# EAGLE design motherboard (EAGLE 5.04)
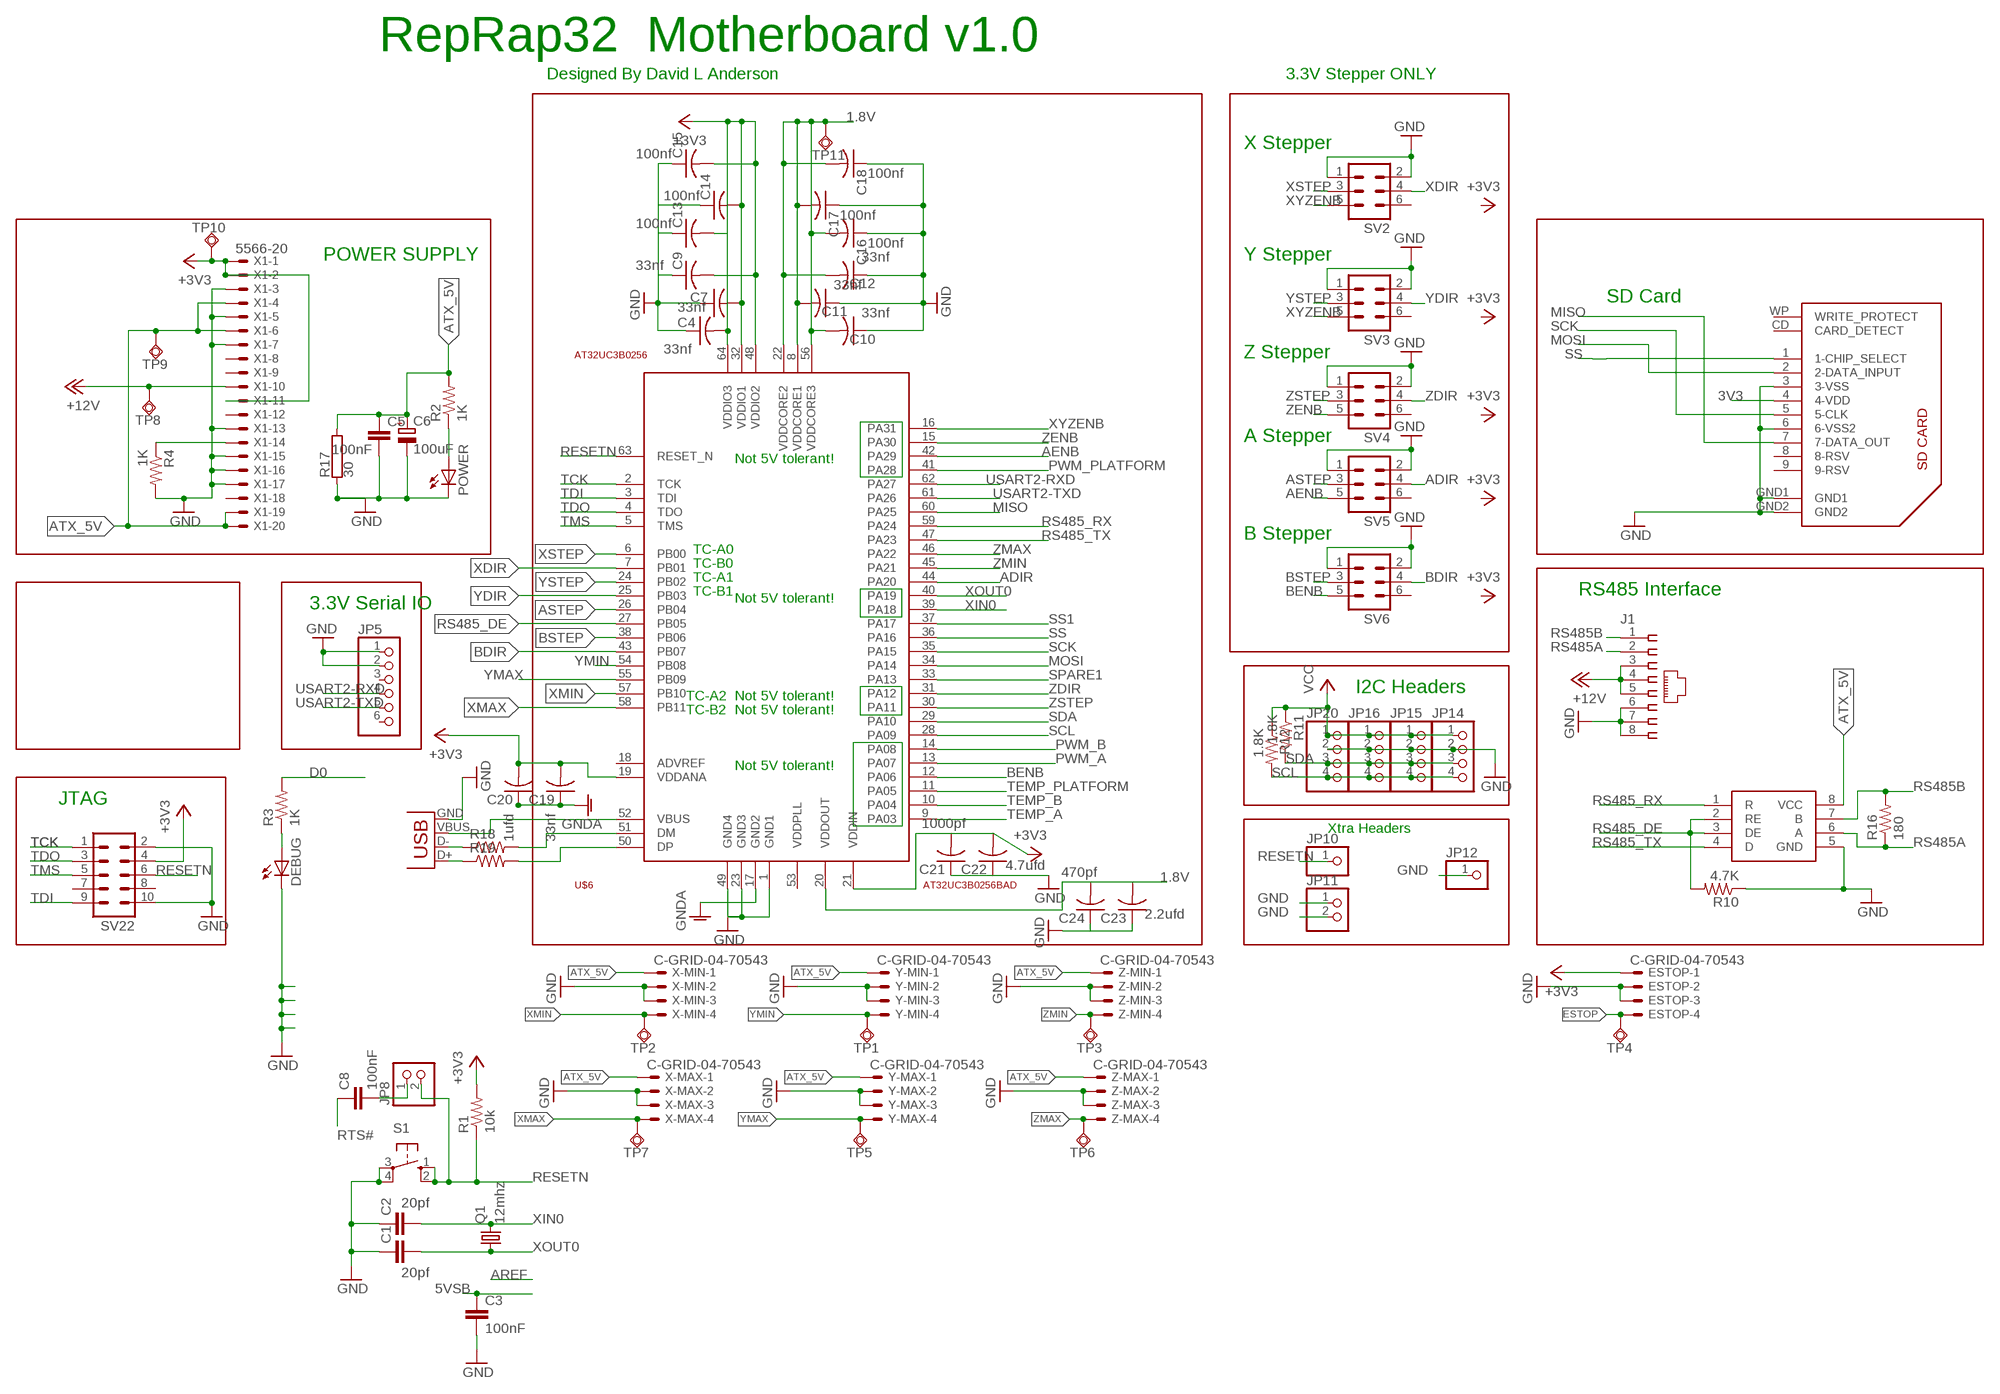
[diagram p0: schematic, sheet 1]

## Parts
C1  20pf  C-EUC1206  [C1206]
C2  20pf  C-EUC1206  [C1206]
C3  100nF  C-EUC1206  [C1206]
C4  33nf  C-USC0603K  [C0603K]
C5  100nF  C-EUC1206  [C1206]
C6  100uF  CPOL-EUSANYO_SMD_B6  [SANYO-OSCON_SMD_B6]
C7  33nf  C-USC0603K  [C0603K]
C8  100nF  C-EUC1206  [C1206]
C9  33nf  C-USC0603K  [C0603K]
C10  33nf  C-USC0603K  [C0603K]
C11  33nf  C-USC0603K  [C0603K]
C12  33nf  C-USC0603K  [C0603K]
C13  100nf  C-USC0603K  [C0603K]
C14  100nf  C-USC0603K  [C0603K]
C15  100nf  C-USC0603K  [C0603K]
C16  100nf  C-USC0603K  [C0603K]
C17  100nf  C-USC0603K  [C0603K]
C18  100nf  C-USC0603K  [C0603K]
C19  33nf  C-USC0603K  [C0603K]
C20  1ufd  C-USC0603K  [C0603K]
C21  1000pf  C-USC0603K  [C0603K]
C22  4.7ufd  C-USC0603K  [C0603K]
C23  2.2ufd  C-USC0603K  [C0603K]
C24  470pf  C-USC0603K  [C0603K]
DEBUG  LEDCHIPLED_1206  [CHIPLED_1206]
ESTOP  C-GRID-04-70543  [70543-04]
IC1  SN75176ASOIC  [SO08]
J1  555164-1  [555164-1]
JP5  PINHD-1X6  [1X06]
JP8  PINHD-1X2  [1X02]
JP10  PINHD-1X1  [1X01]
JP11  PINHD-1X2  [1X02]
JP12  PINHD-1X1  [1X01]
JP14  PINHD-1X4  [1X04]
JP15  PINHD-1X4  [1X04]
JP16  PINHD-1X4  [1X04]
JP20  PINHD-1X4  [1X04]
POWER  LEDCHIPLED_1206  [CHIPLED_1206]
Q1  12mhz  CRYSTAL5X3  [CRYSTAL-SMD-5X3]
R1  10k  R-US_R0603  [R0603]
R2  1K  R-US_R1206  [R1206]
R3  1K  R-US_R1206  [R1206]
R4  1K  R-US_R1206  [R1206]
R10  4.7K  R-US_R1206  [R1206]
R11  1.8K  R-US_R1206  [R1206]
R12  1.8K  R-US_R1206  [R1206]
R16  180  R-US_R1206  [R1206]
R17  30  RKH206-8  [KH206-8]
R18  R-US_R0603  [R0603]
R19  R-US_R0603  [R0603]
S1  10-XX  [B3F-10XX]
SV2  ML6  [ML6]
SV3  ML6  [ML6]
SV4  ML6  [ML6]
SV5  ML6  [ML6]
SV6  ML6  [ML6]
SV22  ML10  [ML10]
TP1  TPSQTP09R  [TP09R]
TP2  TPSQTP09R  [TP09R]
TP3  TPSQTP09R  [TP09R]
TP4  TPSQTP09R  [TP09R]
TP5  TPSQTP09R  [TP09R]
TP6  TPSQTP09R  [TP09R]
TP7  TPSQTP09R  [TP09R]
TP8  TPSQTP09R  [TP09R]
TP9  TPSQTP09R  [TP09R]
TP10  TPSQTP09R  [TP09R]
TP11  TPSQTP09R  [TP09R]
U$6  AT32UC3B0256BAD  [TQFP64]
U$8  SDCARD  [3M-SDCARD]
X1  5566-20  [5566-20]
X2  USBSMD  [USB-MINIB]
X-MAX  C-GRID-04-70543  [70543-04]
X-MIN  C-GRID-04-70543  [70543-04]
Y-MAX  C-GRID-04-70543  [70543-04]
Y-MIN  C-GRID-04-70543  [70543-04]
Z-MAX  C-GRID-04-70543  [70543-04]
Z-MIN  C-GRID-04-70543  [70543-04]

## Nets
1.8V: C10.2 C11.2 C12.2 C16.2 C17.2 C18.2 C23.2 C24.2 TP11.TP U$6.8(VDDCORE1) U$6.20(VDDOUT) U$6.22(VDDCORE2) U$6.56(VDDCORE3)
3V3: U$8.4(4-VDD)
5VSB: C3.1
+3V3: C4.2 C7.2 C9.2 C13.2 C14.2 C15.2 C19.2 C20.2 C21.2 C22.2 ESTOP.1 R1.2 SV22.4 TP10.TP U$6.19(VDDANA) U$6.21(VDDIN) U$6.32(VDDIO1) U$6.48(VDDIO2) U$6.64(VDDIO3) X1.1 X1.2 X1.11
+12V: J1.3 J1.4 J1.5 TP8.TP X1.10
ADIR: SV5.4 U$6.44(PA20)
AENB: SV5.5 U$6.42(PA29)
ASTEP: SV5.3 U$6.26(PB04)
ATX_5V [usbvcc]: C5.1 C6.+ IC1.8(VCC) R2.2 R17.2 TP9.TP X1.4 X1.6 X1.19 X1.20 X-MAX.1 X-MIN.1 Y-MAX.1 Y-MIN.1 Z-MAX.1 Z-MIN.1
BDIR: SV6.4 U$6.43(PB07)
BENB: SV6.5 U$6.12(PA06)
BSTEP: SV6.3 U$6.38(PB06)
D0: R3.2
ESTOP: ESTOP.4 TP4.TP
GND [power]: C1.1 C2.1 C3.2 C4.1 C5.2 C6.- C7.1 C9.1 C10.1 C11.1 C12.1 C13.1 C14.1 C15.1 C16.1 C17.1 C18.1 C21.1 C22.1 C23.1 C24.1 DEBUG.C ESTOP.2 ESTOP.3 IC1.5(GND) J1.6 J1.7 J1.8 JP5.1 JP5.2 JP11.1 JP11.2 JP12.1 JP14.2 JP15.2 JP16.2 JP20.2 POWER.C R4.2 R10.1 R17.1 S1.3(P) S1.4(P1) SV2.1 SV2.2 SV3.1 SV3.2 SV4.1 SV4.2 SV5.1 SV5.2 SV6.1 SV6.2 SV22.2 SV22.10 U$6.1(GND1) U$6.23(GND3) U$6.49(GND4) U$8.3(3-VSS) U$8.6(6-VSS2) U$8.GND1 U$8.GND2 X1.3 X1.5 X1.7 X1.13 X1.15 X1.16 X1.17 X2.GND X-MAX.2 X-MAX.3 X-MIN.2 X-MIN.3 Y-MAX.2 Y-MAX.3 Y-MIN.2 Y-MIN.3 Z-MAX.2 Z-MAX.3 Z-MIN.2 Z-MIN.3
GNDA: C19.1 C20.1 U$6.17(GND2)
MISO: U$6.60(PA25) U$8.7(7-DATA_OUT)
MOSI: U$6.34(PA14) U$8.2(2-DATA_INPUT)
N$3: R18.2 U$6.51(DM)
N$4: POWER.A R2.1
N$5: R4.1 X1.14
N$6: R19.2 U$6.50(DP)
N$7: DEBUG.A R3.1
N$9: R18.1 X2.D-
N$10: R19.1 X2.D+
N$11: U$6.52(VBUS) X2.VBUS
N$21: C8.2 JP8.1
PWM_A: U$6.13(PA07)
PWM_B: U$6.14(PA08)
PWM_PLATFORM: U$6.41(PA28)
RESETN: JP8.2 JP10.1 R1.1 S1.1(S) S1.2(S1) SV22.6 U$6.63(RESET_N)
RS485_DE: IC1.2(RE) IC1.3(DE) R10.2 U$6.27(PB05)
RS485_RX: IC1.1(R) U$6.59(PA24)
RS485_TX: IC1.4(D) U$6.47(PA23)
RS485A: IC1.6(A) J1.2 R16.1
RS485B: IC1.7(B) J1.1 R16.2
RTS#: C8.1
SCK: U$6.35(PA15) U$8.5(5-CLK)
SCL: JP14.4 JP15.4 JP16.4 JP20.4 R12.2 U$6.28(PA09)
SDA: JP14.3 JP15.3 JP16.3 JP20.3 R11.2 U$6.29(PA10)
SPARE1: U$6.33(PA13)
SS: U$6.36(PA16) U$8.1(1-CHIP_SELECT)
SS1: U$6.37(PA17)
TCK: SV22.1 U$6.2(TCK)
TDI: SV22.9 U$6.3(TDI)
TDO: SV22.3 U$6.4(TDO)
TEMP_A: U$6.9(PA03)
TEMP_B: U$6.10(PA04)
TEMP_PLATFORM: U$6.11(PA05)
TMS: SV22.5 U$6.5(TMS)
USART2-RXD: JP5.4 U$6.62(PA27)
USART2-TXD: JP5.5 U$6.61(PA26)
VCC [power]: JP14.1 JP15.1 JP16.1 JP20.1 R11.1 R12.1
XDIR: SV2.4 U$6.7(PB01)
XIN0: C2.2 Q1.3 U$6.39(PA18)
XMAX: TP7.TP U$6.58(PB11) X-MAX.4
XMIN: TP2.TP U$6.57(PB10) X-MIN.4
XOUT0: C1.2 Q1.1 U$6.40(PA19)
XSTEP: SV2.3 U$6.6(PB00)
XYZENB: SV2.5 SV3.5 U$6.16(PA31)
YDIR: SV3.4 U$6.25(PB03)
YMAX: TP5.TP U$6.55(PB09) Y-MAX.4
YMIN: TP1.TP U$6.54(PB08) Y-MIN.4
YSTEP: SV3.3 U$6.24(PB02)
ZDIR: SV4.4 U$6.31(PA12)
ZENB: SV4.5 U$6.15(PA30)
ZMAX: TP6.TP U$6.46(PA22) Z-MAX.4
ZMIN: TP3.TP U$6.45(PA21) Z-MIN.4
ZSTEP: SV4.3 U$6.30(PA11)
Unconnected: JP5.3 JP5.6 SV2.6 SV3.6 SV4.6 SV5.6 SV6.6 SV22.7 SV22.8 U$6.18(ADVREF) U$6.53(VDDPLL) U$8.8(8-RSV) U$8.9(9-RSV) U$8.CD(CARD_DETECT) U$8.WP(WRITE_PROTECT) X1.8 X1.9 X1.12 X1.18

## Notes on the sheet
- RepRap32  Motherboard v1.0
- Designed By David L Anderson | 3.3V Stepper ONLY
- X Stepper
- POWER SUPPLY | Y Stepper
- SD Card
- Z Stepper
- A Stepper
- Not 5V tolerant!
- B Stepper
- TC-A0
- TC-B0
- TC-A1
- TC-B1 | RS485 Interface
- Not 5V tolerant!
- 3.3V Serial IO
- I2C Headers
- TC-A2 | Not 5V tolerant!
- TC-B2 | Not 5V tolerant!
- Not 5V tolerant!
- JTAG
- Xtra Headers

## Library data of the parts
C1-C3 C5 C8 = rcl:C-EU: CAPACITOR, European symbol
C4 C7 C9-C24 = rcl:C-US: CAPACITOR, American symbol
C6 = rcl:CPOL-EU: POLARIZED CAPACITOR, European symbol
DEBUG POWER = led:LED: LED OSRAM: - CHIPLED LG R971, LG N971, LY N971, LG Q971, LY Q971, LO R971, LY R971 LH N974, LH R974 LS Q976, LO Q976, LY Q976 LO Q996 - Hyper CHIPLED LW Q18S LB Q993, LB Q99A, LB R99A - SideLED LS A670, LO A670, LY A670, LG A670, LP A670 LB A673, LV A673, LT A673, LW A673 LH A674 LY A675 LS A676, LA A676, LO A676, LY A676, LW A676 LS A679, LY A679, LG A679 - Hyper Micro SIDELED® LS Y876, LA Y876, LO Y876, LY Y876 LT Y87S - SmartLED LW L88C, LW L88S LB L89C, LB L89S, LG L890 LS L89K, LO L89K, LY L89K LS L896, LA L896, LO L896, LY L896 - TOPLED LS T670, LO T670, LY T670, LG T670, LP T670 LSG T670, LSP T670, LSY T670, LOP T670, LYG T670 LG T671, LOG T671, LSG T671 LB T673, LV T673, LT T673, LW T673 LH T674 LS T676, LA T676, LO T676, LY T676, LB T676, LH T676, LSB T676, LW T676 LB T67C, LV T67C, LT T67C, LS T67K, LO T67K, LY T67K, LW E67C LS E67B, LA E67B, LO E67B, LY E67B, LB E67C, LV E67C, LT E67C LW T67C LS T679, LY T679, LG T679 LS T770, LO T770, LY T770, LG T770, LP T770 LB T773, LV T773, LT T773, LW T773 LH T774 LS E675, LA E675, LY E675, LS T675 LS T776, LA T776, LO T776, LY T776, LB T776 LHGB T686 LT T68C, LB T68C - Hyper Mini TOPLED® LB M676 - Mini TOPLED Santana® LG M470 LS M47K, LO M47K, LY M47K Source: http://www.osram.convergy.de - LUMILED® LXK2-PW12-R00, LXK2-PW12-S00, LXK2-PW14-U00, LXK2-PW14-V00 LXK2-PM12-R00, LXK2-PM12-S00, LXK2-PM14-U00 LXK2-PE12-Q00, LXK2-PE12-R00, LXK2-PE12-S00, LXK2-PE14-T00, LXK2-PE14-U00 LXK2-PB12-K00, LXK2-PB12-L00, LXK2-PB12-M00, LXK2-PB14-N00, LXK2-PB14-P00, LXK2-PB14-Q00 LXK2-PR12-L00, LXK2-PR12-M00, LXK2-PR14-Q00, LXK2-PR14-R00 LXK2-PD12-Q00, LXK2-PD12-R00, LXK2-PD12-S00 LXK2-PH12-R00, LXK2-PH12-S00 LXK2-PL12-P00, LXK2-PL12-Q00, LXK2-PL12-R00 Source: www.luxeon.com
ESTOP X-MAX X-MIN Y-MAX Y-MIN Z-MAX Z-MIN = con-molex:C-GRID-04: CONNECTOR wire to board 2.54 mm (0.100") pitch header
IC1 = reprap:SN75176A
J1 = con-amp:555164-1: AMP connector
JP5 = pinhead:PINHD-1X6: PIN HEADER
JP8 JP11 = pinhead:PINHD-1X2: PIN HEADER
JP10 JP12 = pinhead:PINHD-1X1: PIN HEADER
JP14-JP16 JP20 = pinhead:PINHD-1X4: PIN HEADER
Q1 = SparkFun_4_13_2010:CRYSTAL: Crystals Various standard crystals. Proven footprints. Spark Fun Electronics SKU : COM-00534
R1 R2 R4 R10-R12 R16 R18 R19 = rcl:R-US_: RESISTOR, American symbol
R3 = resistor:R-US_: RESISTOR, American symbol
R17 = resistor-power:R: Power Resitor
S1 = switch-omron:10-XX: OMRON SWITCH
SV2-SV6 = con-ml:ML6: HARTING
SV22 = con-harting-ml:ML10: HARTING
TP1-TP11 = testpad:TPSQ: Test pad
U$6 = dave2010:AT32UC3B0256
U$8 = reprap:SDCARD
X1 = con-molex:5566-20: Mini FIT connector 20 pol ATX PC-Motherboard Power connector Source: http://www.molex.com
X2 = SparkFun_4_13_2010:USB: USB Connectors USB-B-PTH is fully proven SKU : PRT-00139 USB-miniB is fully proven SKU : PRT-00587 USB-A-PCB is untested. USB-A-H is throughly reviewed, but untested. Spark Fun Electronics SKU : PRT-00437 USB-B-SMT is throughly reviewed, but untested. Needs silkscreen touching up. USB-A-S has not been used/tested USB-MB-H has not been used/tested

## Net classes
0 default: width 0.406 mm, clearance 0.305 mm
1 power: width 0.635 mm, clearance 0.406 mm
2 gnd: width 0.305 mm, drill 0.711 mm, clearance 0.203 mm
3 usbvcc: width 0.508 mm, drill 0.711 mm, clearance 0.203 mm

## Board
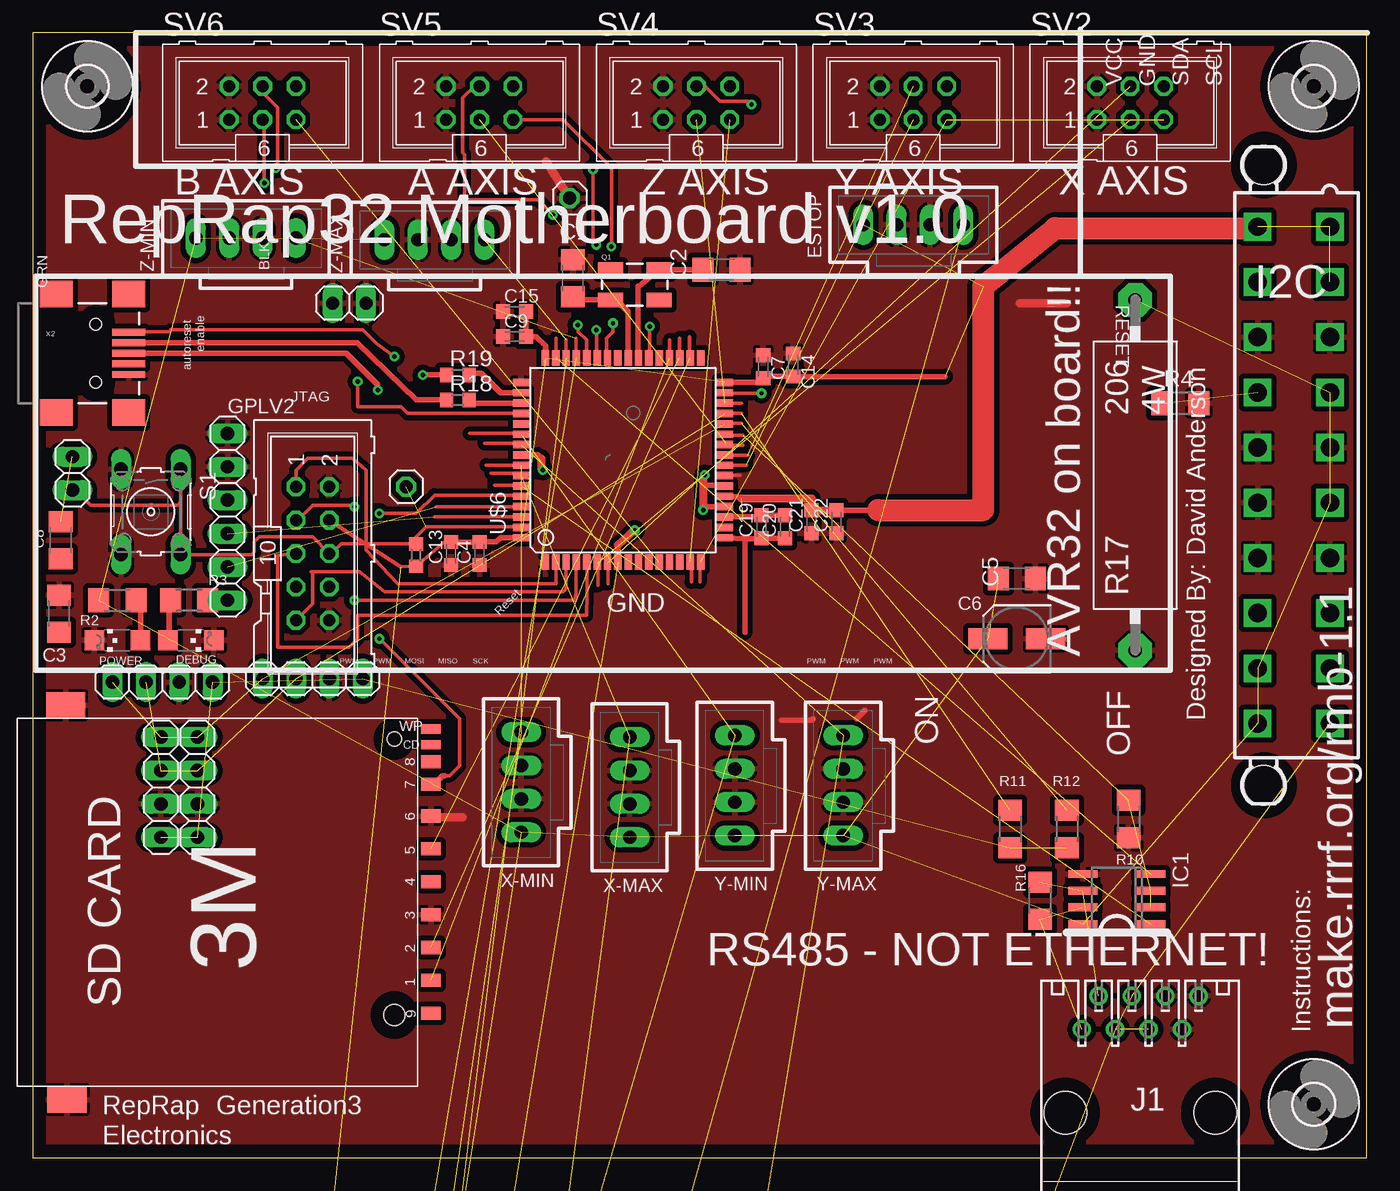
[diagram p1: board, top side]
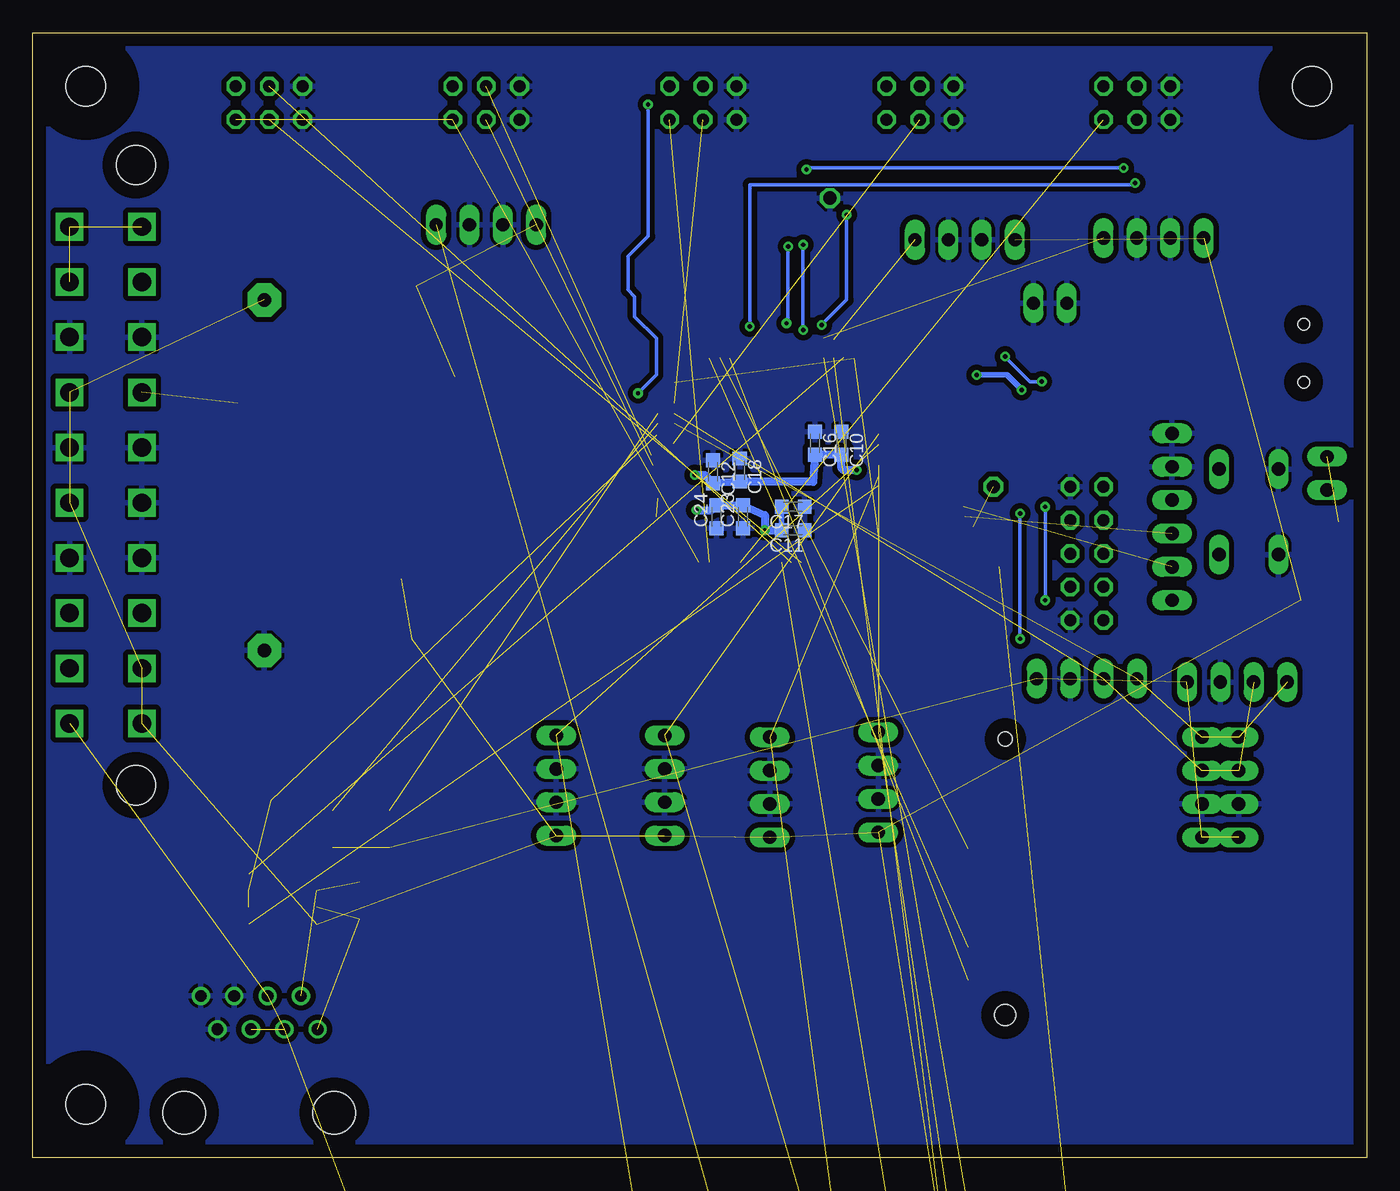
[diagram p2: board, bottom side, seen from below]

Size 101.52 x 85.59 mm. Coordinates in mm from the lower left corner, seen from the top.
Outline: 0,0 101.52,0 101.52,85.59 0,85.59 0,0
Copper layers (1*16): Top 0.035mm / dielectric 1.5mm / Bottom 0.035mm
Design rules "default *": minimum track width 10mil, minimum drill 24mil, track to track 8mil, track to pad 8mil, pad to pad 8mil, via to via 8mil, smd to smd 8mil, copper to edge 40mil, drill to drill 8mil, minimum pad ring 10mil, minimum via ring 8mil, stop-mask expansion 4mil, vias tented up to drill 0mil, thermal gap 10mil

### Footprints (pad centres in the part's own frame; a part is rotated, then mirrored left to right if it is on the bottom)
C1206 = smd 1.6 x 1.8: 1 -1.4,0; 2 1.4,0
C0603K = smd 1.05 x 1.08: 1 -0.875,0; 2 0.875,0
SANYO-OSCON_SMD_B6 = smd 3 x 1.6: + 2.2,0; - -2.2,0
CHIPLED_1206 = smd 1.5 x 1.5: A 0,-1.75; C 0,1.75
70543-04 = drill 1.016 long: 1 -3.81,0; 2 -1.27,0; 3 1.27,0; 4 3.81,0
SO08 = smd 0.6 x 2.2: 1 -1.905,-2.6; 2 -0.635,-2.6; 3 0.635,-2.6; 4 1.905,-2.6; 5 1.905,2.6; 6 0.635,2.6; 7 -0.635,2.6; 8 -1.905,2.6
555164-1 = drill 0.889 round: 1 -4.445,5.207; 2 -3.175,7.747; 3 -1.905,5.207; 4 -0.635,7.747; 5 0.635,5.207; 6 1.905,7.747; 7 3.175,5.207; 8 4.445,7.747 | hole 3.251: -5.715,-1.143; 5.715,-1.143
1X06 = drill 1.016 long: 1 -6.35,0; 2 -3.81,0; 3 -1.27,0; 4 1.27,0; 5 3.81,0; 6 6.35,0
1X02 = drill 1.016 long: 1 -1.27,0; 2 1.27,0
1X01 = drill 1.016 octagon: 1 0,0
1X04 = drill 1.016 long: 1 -3.81,0; 2 -1.27,0; 3 1.27,0; 4 3.81,0
CRYSTAL-SMD-5X3 = smd 1.9 x 1.1: 1 -1.85,-1.15; 2 1.85,-1.15; 3 1.85,1.15; 4 -1.85,1.15
R0603 = smd 1 x 1.1: 1 -0.85,0; 2 0.85,0
R1206 = smd 1.6 x 1.803: 1 -1.422,0; 2 1.422,0
KH206-8 = drill 1.016 pad 2.54 octagon: 1 -13.335,0; 2 13.335,0
B3F-10XX = drill 1.016 long: 1 -3.251,2.261; 2 3.251,2.261; 3 -3.251,-2.261; 4 3.251,-2.261
ML6 = drill 0.914 octagon: 1 -2.54,-1.27; 2 -2.54,1.27; 3 0,-1.27; 4 0,1.27; 5 2.54,-1.27; 6 2.54,1.27
ML10 = drill 0.914 octagon: 1 -5.08,-1.27; 2 -5.08,1.27; 3 -2.54,-1.27; 4 -2.54,1.27; 5 0,-1.27; 6 0,1.27; 7 2.54,-1.27; 8 2.54,1.27; 9 5.08,-1.27; 10 5.08,1.27
TP09R = smd 0.9 x 0.9: TP 0,0
3,0 = hole 3: 0,0
TQFP64 = smd 1.194 x 0.559: 1 -7.76,5.905; 2 -7.76,5.118; 3 -7.76,4.331; 4 -7.76,3.543; 5 -7.76,2.756; 6 -7.76,1.968; 7 -7.76,1.181; 8 -7.76,0.394; 9 -7.76,-0.394; 10 -7.76,-1.181; 11 -7.76,-1.968; 12 -7.76,-2.756; 13 -7.76,-3.543; 14 -7.76,-4.331; 15 -7.76,-5.118; 16 -7.76,-5.905; 33 7.76,-5.905; 34 7.76,-5.118; 35 7.76,-4.331; 36 7.76,-3.543; 37 7.76,-2.756; 38 7.76,-1.968; 39 7.76,-1.181; 40 7.76,-0.394; 41 7.76,0.394; 42 7.76,1.181; 43 7.76,1.968; 44 7.76,2.756; 45 7.76,3.543; 46 7.76,4.331; 47 7.76,5.118; 48 7.76,5.905 | smd 0.559 x 1.194: 17 -5.905,-7.76; 18 -5.118,-7.76; 19 -4.331,-7.76; 20 -3.543,-7.76; 21 -2.756,-7.76; 22 -1.968,-7.76; 23 -1.181,-7.76; 24 -0.394,-7.76; 25 0.394,-7.76; 26 1.181,-7.76; 27 1.968,-7.76; 28 2.756,-7.76; 29 3.543,-7.76; 30 4.331,-7.76; 31 5.118,-7.76; 32 5.905,-7.76; 49 5.905,7.76; 50 5.118,7.76; 51 4.331,7.76; 52 3.543,7.76; 53 2.756,7.76; 54 1.968,7.76; 55 1.181,7.76; 56 0.394,7.76; 57 -0.394,7.76; 58 -1.181,7.76; 59 -1.968,7.76; 60 -2.756,7.76; 61 -3.543,7.76; 62 -4.331,7.76; 63 -5.118,7.76; 64 -5.905,7.76
3M-SDCARD = smd 1 x 1.5: 1 5.93,16.5; 2 3.43,16.5; 3 0.93,16.5; 4 -1.57,16.5; 5 -4.07,16.5; 6 -6.57,16.5; 7 -9,16.5; 8 -10.7,16.5; 9 8.43,16.5 | smd 0.7 x 1.5: CD -12,16.5; WP -13.2,16.5 | smd 2 x 3: GND1 -15,-11.3; GND2 15,-11.2 | hole 1.1: -12.427,13.705 | hole 1.6: 8.567,13.708
5566-20 = drill 1.4 square: 1 18.9,-2.75; 2 14.7,-2.75; 3 10.5,-2.75; 4 6.3,-2.75; 5 2.1,-2.75; 6 -2.1,-2.75; 7 -6.3,-2.75; 8 -10.5,-2.75; 9 -14.7,-2.75; 10 -18.9,-2.75; 11 18.9,2.75; 12 14.7,2.75; 13 10.5,2.75; 14 6.3,2.75; 15 2.1,2.75; 16 -2.1,2.75; 17 -6.3,2.75; 18 -10.5,2.75; 19 -14.7,2.75; 20 -18.9,2.75 | hole 3: 23.6,2.29; -23.6,2.29
USB-MINIB = smd 2.5 x 0.5: D+ 2.5,0; D- 2.5,0.8; GND 2.5,-1.6; ID 2.5,-0.8; VBUS 2.5,1.6 | smd 2.5 x 2: GND@1 -3,-4.5; GND@2 -3,4.5; GND@3 2.5,4.5; GND@4 2.5,-4.5 | hole 0.9: 0,2.2; 0,-2.2

### Placement (x,y rotation side)
C1  41.11,66.92 270 top
C2  52.41,67.56 180 top
C3  1.99,41.4 90 top
C4  34,45.97 90 top
C5  74.89,44.06 0 top
C6  74.89,39.49 180 top
C7  55.59,60.19 270 top
C8  2.12,46.98 90 top
C9  36.66,62.48 0 top
C10  39.97,54.35 270 bottom
C11  43.65,47.75 180 bottom
C12  49.75,52.19 270 bottom
C13  31.84,45.97 90 top
C14  57.87,60.32 270 top
C15  36.66,64.38 0 top
C16  42,54.35 270 bottom
C17  43.65,49.53 180 bottom
C18  47.71,52.32 270 bottom
C19  55.46,48 90 top
C20  57.24,48 90 top
C21  59.27,48.38 90 top
C22  61.18,48.38 90 top
C23  47.46,48.76 90 bottom
C24  49.49,48.76 90 bottom
DEBUG  12.03,39.37 270 top
ESTOP  67.02,70.99 0 top
IC1  82.51,19.68 90 top
J1  84.29,4.57 0 top
JP5  14.82,48.76 270 top
JP8  3.01,52.07 270 top
JP10  28.41,51.05 0 top
JP11  24.09,65.02 0 top
JP12  40.86,73.02 0 top
JP14  12.54,28.19 90 top
JP15  9.87,36.19 180 top
JP16  21.3,36.44 180 top
JP20  9.74,28.19 90 top
POWER  6.44,39.37 90 top
Q1  45.81,66.42 0 top
R1  29.17,45.84 270 top
R2  6.44,42.41 180 top
R3  11.9,42.41 0 top
R4  87.34,57.4 0 top
R10  83.4,25.78 90 top
R11  74.38,25.01 90 top
R12  78.7,25.01 90 top
R16  76.67,19.55 270 top
R17  83.91,51.94 90 top
R18  32.35,57.65 0 top
R19  32.35,59.56 0 top
S1  8.98,49.14 270 top
SV2  83.53,80.26 0 top
SV3  67.02,80.26 0 top
SV4  50.51,80.26 0 top
SV5  34,80.26 0 top
SV6  17.49,80.26 0 top
SV22  21.3,45.97 270 top
TP1  7.33,-124.21 0 top  (outside the outline)
TP2  7.33,-169.93 0 top  (outside the outline)
TP3  7.33,-139.45 0 top  (outside the outline)
TP4  7.33,-154.69 0 top  (outside the outline)
TP5  23.84,-195.33 0 top  (outside the outline)
TP6  7.33,-205.49 0 top  (outside the outline)
TP7  13.68,-205.49 0 top  (outside the outline)
TP8  -0.29,-210.57 0 top  (outside the outline)
TP9  -0.29,-215.65 0 top  (outside the outline)
TP10  -0.29,-220.73 0 top  (outside the outline)
TP11  -0.29,-225.81 0 top  (outside the outline)
U$3  [3,0]  4.15,81.53 0 top
U$4  [3,0]  97.5,81.53 0 top
U$5  [3,0]  97.5,4.06 0 top
U$6  44.92,53.08 90 top
U$8  13.81,19.43 270 top
X1  95.97,51.94 90 top
X2  4.79,61.21 0 top
X-MAX  45.43,28.19 90 top
X-MIN  37.17,28.57 90 top
Y-MAX  61.68,28.32 90 top
Y-MIN  53.43,28.32 90 top
Z-MAX  30.57,69.84 0 top
Z-MIN  16.22,69.97 0 top

### Tracks (layer width: path | path; a pad name or v marks a point on that pad's centre or on a via)
1.8V  (via drill 0.33)  (1 unrouted)
  Top 0.406: U$6.20 51.13,49.54 51.02,49.65 v51.02,49.27 | 51.02,51.05 51.14,51.18 52.62,51.18 U$6.22 | v51.14,51.94 51.02,51.81 | U$6.56 38.43,53.48 38.7,53.21 | 38.7,52.45 v38.82,52.32 | U$6.8 44.54,46.6
  Top 0.61: 51.02,49.65 51.02,51.05 51.02,51.81 | 38.7,53.21 38.7,52.45 | v45.81,47.75 44.54,46.6
  Bottom 0.406: 49.86,49.27 C24.2 | 39.84,52.32 39.97,52.45 | C11.2 C17.2
  Bottom 0.61: v51.14,51.94 50.37,51.94 C12.2 C18.2 42.13,51.43 C16.2 C10.2 39.97,52.45 | v51.02,49.27 49.86,49.27 | C24.2 C23.2 45.81,48.89 v45.81,47.75 C11.2 | v38.82,52.32 39.84,52.32
+3V3  (8 unrouted)
  Top 0.254: C13.2 31.31,46.82 R1.2 27.99,44.95 SV22.4
  Top 0.406: U$6.19 54.71,48.75 54.06,48.76 55.35,48.76 C19.2 C20.2 | U$6.21 53.53,50.29 53.94,50.16 | U$6.32 55.26,58.99 C7.2 55.72,59.45 C14.2 57.89,59.43 69.43,59.43 | U$6.48 39.02,61.78 38.32,62.48 C9.2 C15.2 | U$6.64 35.59,47.18 35.27,46.86 34.01,46.86 C4.2 C13.2 | 64.35,49.27 64.34,49.26 C22.2
  Top 0.61: 53.94,50.16 59.27,50.16 C21.2 C22.2
  Top 1.676: X1.11 93.12,70.73 77.81,70.73 72.35,66.29 72.35,49.27 64.35,49.27
+12V  (4 unrouted)
ADIR  (via drill 0.33)
  Top 0.254: U$6.44 arc-90 42.13,60.88 42.13,62.23 41.49,62.86 v41.49,63.37 | SV5.4 33.62,81.53 32.73,80.64 32.73,76.45 32.86,76.32 32.86,72.89 38.44,72.89 v39.59,71.75
  Bottom 0.254: v39.59,71.75 39.59,65.27 v41.49,63.37
AENB  (via drill 0.33)
  Top 0.254: U$6.42 arc-90 43.65,60.93 43.65,62.35 44.16,62.86 v44.16,63.5 | SV5.5 40.35,78.99 44.03,75.31 v44.03,69.34
  Bottom 0.254: v44.03,69.34 44.03,63.62 v44.16,63.5
ASTEP  (1 unrouted)
  Top 0.254: U$6.26 52.77,54.35 52.79,54.35 52.92,54.22 54.06,54.22
ATX_5V  (15 unrouted)
BDIR  (via drill 0.33)
  Top 0.254: U$6.43 arc-90 42.89,60.9 42.89,61.34 | 42.89,61.34 42.89,62.23 | SV6.4 17.49,81.02 18.63,79.88 18.63,75.43 v18.5,75.31 | v42.63,75.18 42.63,69.72 v42.89,69.46 | v42.89,62.99 42.89,61.34
  Bottom 0.254: v18.5,75.31 42.51,75.31 v42.63,75.18 | v42.89,69.46 v42.89,62.99
BENB  (1 unrouted)
BSTEP  (via drill 0.33)
  Top 0.254: U$6.38 arc90 46.95,60.9 v46.95,63.24 | SV6.3 arc-90 17.61,78.86 v17.61,74.16
  Bottom 0.254: v17.61,74.16 arc90 17.74,74.04 46.95,74.04 v46.95,63.24
ESTOP  (1 unrouted)
GND
  Top 0.254: U$6.23 52.72,51.94 53.81,51.94
  Top 0.406: 56.98,33.27 59.27,33.27 59.4,33.4 | 63.34,34.03 62.7,33.4
  Top 0.635: 32.73,25.9 30.95,25.9 U$8.6 | JP12.1 39.08,75.81 | 75.15,65.02 78.7,65.02
  pour Top: -1.56,86.61 102.58,86.61 102.58,-1.02 -1.56,-1.02
  pour Bottom: -1.56,86.61 102.58,86.61 102.58,-1.02 -1.56,-1.02
GNDA
  Top 0.406: 54.19,47.11 U$6.17 | 54.19,40 54.19,47.11 | C20.1 C19.1 55.7,47.11 54.19,47.11
MISO  (via drill 0.33)
  Top 0.254: U$6.60 37.07,50.41 35.52,50.41 | 35.52,50.41 35.01,50.41 | 31.33,29.08 31.71,29.08 32.47,29.84 32.47,33.4 v26.38,39.49 | v26.38,49.02 29.17,49.02 30.57,50.41 35.52,50.41
  Top 0.406: 31.33,29.08 31.2,29.08 30.95,28.82 U$8.7
  Bottom 0.254: v26.38,39.49 v26.38,49.02
MOSI  (1 unrouted)
  Top 0.254: U$6.34 50,60.88 50,62.48
N$3
  Top 0.406: U$6.51 33.31,57.41 R18.2
N$4
  Top 0.406: POWER.A 8.22,40 8.22,41.52 R2.1
N$5  (1 unrouted)
N$6
  Top 0.406: U$6.50 35.61,58.2 34.12,59.69 33.32,59.69 R19.2
N$7
  Top 0.406: DEBUG.A 10.38,40 10.38,41.52 R3.1
N$9
  Top 0.406: X2.D- 24.69,62.01 29.17,57.65 R18.1
N$10  (via drill 0.33)
  Top 0.406: v29.68,59.56 R19.1 | v26.25,58.41 26.25,58.8 23.84,61.21 X2.D+
  Bottom 0.406: v29.68,59.56 27.39,59.56 v26.25,58.41
N$11  (via drill 0.33)
  Top 0.254: U$6.52 28.54,56.64 28.03,57.15 24.73,57.15 v24.73,59.05 | X2.VBUS 7.34,62.86 10.38,62.86 10.5,62.99 25.11,62.99 26.12,61.97 v27.52,60.96
  Bottom 0.254: v27.52,60.96 25.62,59.05 v24.73,59.05
N$21  (1 unrouted)
RESETN  (1 unrouted)
  Top 0.254: U$6.63 37.12,48 29.93,48 29.17,47.24 R1.1 29.13,46.73 23.46,46.73 22.7,45.97 SV22.6 21.3,47.24 17.23,47.24 16.85,46.86 16.85,46.1 16.65,45.89 S1.2 S1.1 11.27,52.37 11.27,49.91 11.01,49.65 4.41,49.65 3.26,50.8 JP8.2
RS485_DE  (3 unrouted)
  Top 0.254: U$6.27 52.74,54.99 54.06,54.99
RS485_RX  (1 unrouted)
  Top 0.254: U$6.59 37.1,51.18 35.14,51.18
RS485_TX  (1 unrouted)
  Top 0.254: U$6.47 arc90 39.84,60.88 39.84,62.35
RS485A  (2 unrouted)
RS485B  (2 unrouted)
SCK  (1 unrouted)
  Top 0.254: U$6.35 49.24,60.85 49.24,62.35
SCL  (5 unrouted)
  Top 0.254: U$6.28 52.72,55.88 53.94,55.88
SDA  (5 unrouted)
  Top 0.254: U$6.29 52.69,56.64 53.94,56.64
SS  (1 unrouted)
  Top 0.254: U$6.36 48.48,60.85 48.48,62.23
TCK
  Top 0.254: U$6.2 39.84,45.28 39.84,43.68 27.77,43.68 25.36,46.22 25.36,52.32 24.35,53.21 20.92,53.21 20.03,52.32 SV22.1
TDI
  Top 0.254: SV22.9 21.3,42.16 21.3,44.57 | 21.3,44.57 21.17,44.57 | 21.3,44.57 24.85,44.57 26.76,43.05 40.35,43.05 40.59,43.29 U$6.3
TDO  (via drill 0.33)
  Top 0.254: U$6.4 41.36,45.31 41.36,42.92 41.24,42.41 v24.47,42.41 | v24.47,49.53 24.35,49.65 21.3,49.65 20.15,48.51 SV22.3
  Bottom 0.254: v24.47,42.41 v24.47,49.53
TMS
  Top 0.254: SV22.5 18.63,45.84 18.63,38.86 24.09,38.86 24.73,39.49 24.73,41.27 42.13,41.27 42.16,42.83 U$6.5
USART2-RXD  (1 unrouted)
  Top 0.254: U$6.62 37.15,48.76 30.57,48.76
USART2-TXD  (1 unrouted)
  Top 0.254: U$6.61 37.15,49.53 30.7,49.53
VCC  (5 unrouted)
XDIR  (1 unrouted)
  Top 0.254: U$6.7 43.78,45.28 43.78,43.68
XIN0
  Top 0.406: U$6.39 46.06,60.84 46.06,66.29 46.13,66.29 Q1.3 C2.2
XMAX  (2 unrouted)
  Top 0.254: U$6.58 37,52.07 34.89,52.07
XMIN  (2 unrouted)
  Top 0.254: U$6.57 37.15,52.7 34.51,52.7
XOUT0
  Top 0.406: U$6.40 45.31,64.37 44.54,65.15 44.08,65.15 Q1.1 41.37,65.27 C1.2
XSTEP  (1 unrouted)
  Top 0.254: U$6.6 43.02,45.26 43.02,43.56
XYZENB  (2 unrouted)
  Top 0.254: U$6.16 50.76,45.26 50.76,43.81
YDIR  (1 unrouted)
  Top 0.254: U$6.25 52.69,53.46 54.45,53.46
YMAX  (2 unrouted)
  Top 0.254: U$6.55 37.07,54.35 34.38,54.35
YMIN  (2 unrouted)
  Top 0.254: U$6.54 37.1,55.11 33.24,55.11
YSTEP  (1 unrouted)
  Top 0.254: U$6.24 52.69,52.7 54.32,52.7
ZDIR  (via drill 0.33)
  Top 0.254: U$6.31 52.72,58.16 v55.46,58.16 | SV4.4 51.14,81.53 52.29,80.39 54.45,80.39 v54.7,80.13
  Bottom 0.254: v54.7,80.13 54.7,70.1 56.22,68.57 56.22,66.03 55.72,65.53 55.72,64 54.06,62.35 54.06,59.56 v55.46,58.16
ZENB  (1 unrouted)
  Top 0.254: U$6.15 50.13,45.23 50.13,43.81
ZMAX  (2 unrouted)
  Top 0.254: U$6.46 arc90 40.6,60.85 40.6,62.23
ZMIN  (2 unrouted)
  Top 0.254: U$6.45 arc-90 41.36,60.85 41.36,62.35
ZSTEP  (1 unrouted)
  Top 0.254: U$6.30 52.69,57.4 53.94,57.4

### Text on the board
tPlace: VCC | GND | SDA | SCL | B AXIS | A AXIS | Z AXIS | Y AXIS | X AXIS | RepRap32 Motherboard v1.0 | I2C | BLK | GRN | AVR32 on board!! | RESET | enable | autoreset | JTAG | GPLV2 | Reset | GND | C3 | PWM | PWM | MOSI | MISO | SCK | PWM | PWM | PWM | ON | OFF | Designed By: David Anderson | RS485 - NOT ETHERNET! | make.rrrf.org/rmb-1.1 | Instructions: | RepRap | Generation3 | Electronics